# Altium schematic sheet Sheet1.SchDoc
size A4; SheetNumber: 1; SheetTotal: 2
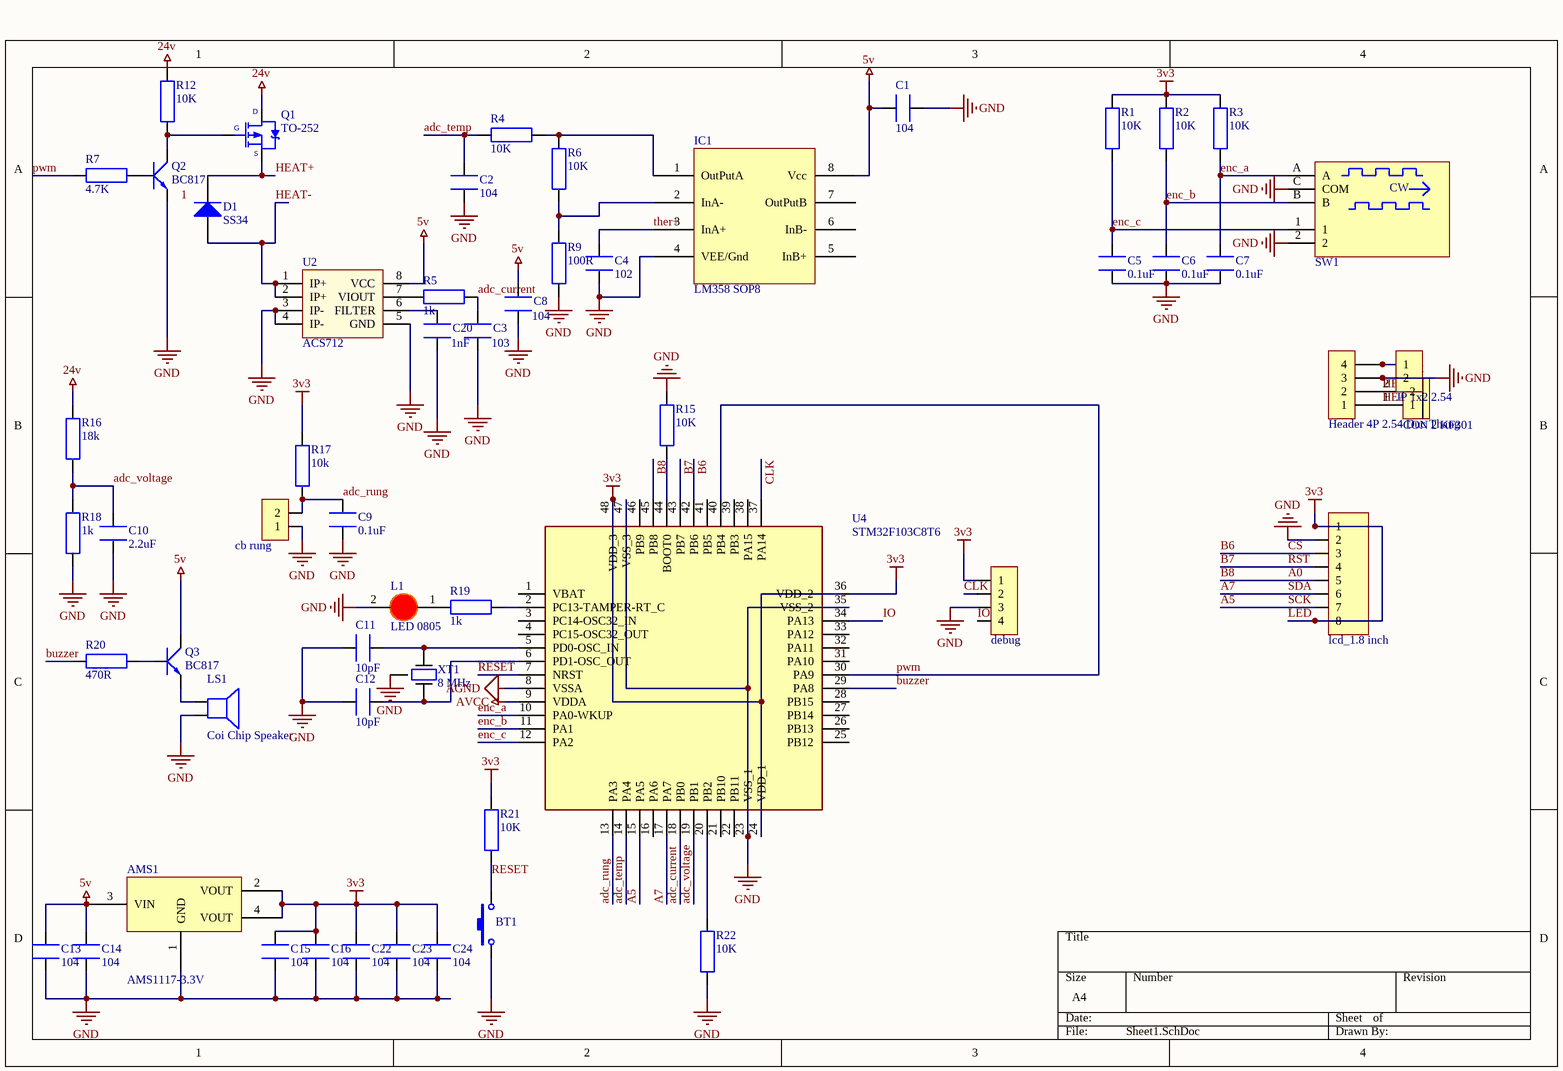
[diagram p0: Sheet1.SchDoc]

## Parts
AMS1  AMS1117-3.3V  [SOT223]
BT1  Nut Nhan 2 Chan SMD 3x6x2.5  [Nut Nhan 2 Chan SMD 3x6x2.5]  (value not drawn)
C1  104  [CAPC1608X09L]
C2  104  [CAPC1608X09L]
C3  103  [CAPC1608X09L]
C4  102  [CAPC1608X09L]
C5  0.1uF  [CAPC1608X09L]
C6  0.1uF  [CAPC1608X09L]
C7  0.1uF  [CAPC1608X09L]
C8  104  [CAPC1608X09L]
C9  0.1uF  [CAPC1608X09L]
C10  2.2uF  [CAPC1608X09L]
C11  10pF  [CAPC1608X09L]
C12  10pF  [CAPC1608X09L]
C13  104  [CAPC1608X09L]
C14  104  [CAPC1608X09L]
C15  104  [CAPC1608X09L]
C16  104  [CAPC1608X09L]
C20  1nF  [CAPC1608X09L]
C22  104  [CAPC1608X09L]
C23  104  [CAPC1608X09L]
C24  104  [CAPC1608X09L]
D1  SS34  [DIODE SMA]
H1  Header 4P 2.54 Duc Thang  [XH2.54M-4]
IC1  LM358 SOP8  [SOP 8]
JP1  debug  [JP 1x4 DT]
JP2  JP 1x2 2.54  [JP 1x2 DT]
JP3  cb rung  [JP 1x2 DT]
JP4  lcd_1.8 inch  [JP 1x8 DT]
KF2  CON 2 KF301  [Con 2 KF301 5.08]
L1  LED 0805  [LED-0805-Red]
LS1  Coi Chip Speaker  [Coi Chip Speacker]
Q1  TO-252  [TO-252-3_L6.6-W6.1-P4.57-LS9.9-BR-CW]
Q2  BC817  [SOT-23]
Q3  BC817  [SOT-23]
R1  10K  [RESC1608X55N]
R2  10K  [RESC1608X55N]
R3  10K  [RESC1608X55N]
R4  10K  [RESC1608X55N]
R5  1k  [RESC1608X55N]
R6  10K  [RESC1608X55N]
R7  4.7K  [RESC1608X55N]
R9  100R  [RESC1608X55N]
R12  10K  [RESC1608X55N]
R15  10K  [RESC1608X55N]
R16  18k  [RESC1608X55N]
R17  10k  [RESC1608X55N]
R18  1k  [RESC1608X55N]
R19  1k  [RESC1608X55N]
R20  470R  [RESC1608X55N]
R21  10K  [RESC1608X55N]
R22  10K  [RESC1608X55N]
SW1  482024764004  [482024764004]  (value not drawn)
U2  ACS712  [SOIC8_50_328_25X90_SMT]
U4  STM32F103C8T6  [LQFP-48_19.6_393_58X11_SMD]
XT1  8 MHz  [DFN220P320X110-4N]

## Nets
5v: AMS1.3(VIN) C1.2 C8.1 C13.2 C14.2 IC1.8(Vcc) Q3.3(C) U2.8(VCC)
24v: Q1.2(D) R12.2 R16.1
AGND: U4.8(VSSA)
AVCC: U4.9(VDDA)
GND: AMS1.1(GND) BT1.1 C1.1 C2.2 C3.2 C4.1 C5.1 C6.1 C7.1 C8.2 C9.2 C10.2 C11.1 C12.1 C13.1 C14.1 C15.1 C16.1 C20.2 C22.1 C23.1 C24.1 H1.3 IC1.4(VEE/Gnd) JP1.3 JP2.2 JP3.1 JP4.2 L1.2(K) LS1.2 Q2.2(E) R9.1 R15.2 R18.2 R22.1 SW1.2 SW1.C(COM) U2.3(IP-) U2.4(IP-) U2.5(GND) U4.23(VSS_1) U4.35(VSS_2) U4.47(VSS_3) XT1.G
LED: AMS1.2(VOUT) AMS1.4(VOUT) C15.2 C16.2 C22.2 C23.2 C24.2 JP1.1 JP4.1 JP4.8 R1.2 R2.2 R3.2 R17.1 R21.2 U4.24(VDD_1) U4.36(VDD_2) U4.48(VDD_3)  [also labelled 3v3]
A0: JP4.5 U4.45(PB8)  [also labelled B8]
A5: JP4.7 U4.15(PA5)  [also labelled SCK]
A7: JP4.6 U4.17(PA7)  [also labelled SDA]
adc_current: C3.1 R5.2 U4.18(PB0)
adc_rung: C9.1 JP3.2 R17.2 U4.13(PA3)
adc_temp: C2.1 R4.2 U4.14(PA4)
adc_voltage: C10.1 R16.2 R18.1 U4.19(PB1)
B6: JP4.3 U4.42(PB6)  [also labelled CS]
B7: JP4.4 U4.43(PB7)  [also labelled RST]
buzzer: R20.2 U4.29(PA8)
CLK: JP1.2 U4.37(PA14)
enc_a: C7.2 R3.1 SW1.A U4.10(PA0-WKUP)
enc_b: C6.2 R2.1 SW1.B U4.11(PA1)
enc_c: C5.2 R1.1 SW1.1 U4.12(PA2)
HEAT+: D1.2(K) H1.2 KF2.2 Q1.3(S)
HEAT-: D1.1(A) H1.1 KF2.1 U2.1(IP+) U2.2(IP+)
IO: JP1.4 U4.34(PA13)
pwm: R7.2 U4.30(PA9) U4.40(PB4)
RESET: BT1.2 R21.1 U4.7(NRST)
ther+: C4.2 H1.4 IC1.3(InA+) JP2.1
NetC11_2: C11.2 U4.5(PD0-OSC_IN) XT1.1
NetC12_2: C12.2 U4.6(PD1-OSC_OUT) XT1.3
NetC20_1: C20.1 U2.6(FILTER)
NetIC1_1: IC1.1(OutPutA) R4.1 R6.2
NetIC1_2: IC1.2(InA-) R6.1 R9.2
NetL1_1: L1.1(A) R19.2
NetLS1_1: LS1.1 Q3.2(E)
NetQ1_1: Q1.1(G) Q2.3(C) R12.1
NetQ2_1: Q2.1(B) R7.1
NetQ3_1: Q3.1(B) R20.1
NetR5_1: R5.1 U2.7(VIOUT)
NetR15_1: R15.1 U4.44(BOOT0)
NetR19_1: R19.1 U4.2(PC13-TAMPER-RT_C)
NetR22_2: R22.2 U4.20(PB2)

Not connected (* = marked no-connect by the designer): IC1 5(InB+) 6(InB-) 7(OutPutB); U4 1(VBAT) 3(PC14-OSC32_IN) 4(PC15-OSC32_OUT) 16(PA6) 21(PB10) 22(PB11) 25(PB12) 26(PB13) 27(PB14) 28(PB15) 31(PA10) 32(PA11) 33(PA12) 38(PA15) 39(PB3) 41(PB5) 46(PB9)

## Notes on the sheet
- Labels drawn without touching a wire or pin: 1
- (in symbol 482024764004) CW

## Library data of the parts
AMS1 = AMS1117 SMD: Dán; Value: AMS1117-3.3V SOT223; Don_Vi: Con; Ma_Hang: MH000596; Ghi_Chu: *; Kieu_Chan: *; Chung_Loai: Dán
BT1 = Nut Nhan 2 Chan SMD 3x6x2.5: Ma_Hang: MH001036; Ten: Nút Nhấn 2 Chân 3x6x2.5MM SMD
C1-C16 C20 C22-C24 = GRM188R71H104KA93D: CAP CER 0.1UF 50V X7R 0603; Manufacturer: Murata Electronics North America; Tolerance: ±10%; Supplier 1: Digi-Key; Supplier Part Number 1: 490-1519-2-ND; Manufacturer Part Number: GRM188R71H104KA93D; RoHS: RoHS Compliant; Category: Capacitors; Pricing 1: 4000=0.01822, 8000=0.01663, 12000=0.01584 (USD); Packaging: Tape & Reel (TR); Capacitance: 0.1uF; Voltage - Rated: 50V; Temperature Coefficient: X7R; Mounting Type: Surface Mount, MLCC; Operating Temperature: -55°C ~ 125°C; Applications: General Purpose; Ratings: -; Package / Case: 0603 (1608 Metric); Size / Dimension: 0.063" L x 0.032" W (1.60mm x 0.80mm); Height - Seated (Max): -; Thickness (Max): 0.035" (0.90mm); Lead Spacing: -; Features: -; Lead Style: -; ComponentLink1URL: http://www.murata.com/~/media/webrenewal/support/library/catalog/products/capacitor/mlcc/c02e.ashx?la=en-us; ComponentLink1Description: http://www.murata.com/~/media/webrenewal/support/library/catalog/products/capacitor/mlcc/c02e.ashx?la=en-us; Stock: 19812000; Part Status: Active; Supplier 2: Digi-Key; Supplier Part Number 2: 490-1519-1-ND; Pricing 2: 1=0.12, 10=0.084, 100=0.0396, 500=0.02778, 1000=0.023 (USD)
D1 = Diode SS34 ( 1N5822 ): Dán; Don_Vi: Con; Ma_Hang: MH002104; Ten_Linh_Kien: Diode SS34 3A 40V SMA ( 1N5822 SS34A); Kieu_Chan: *; Chung_Loai: Dán
H1 = Header 4P 2.54 Duc Thang: Cắm; Ten_Linh_Kien: Header 4P XH2.54-4P Đực Thẳng; Don_Vi: Con; Ma_Hang: MH001285; Chung_Loai: Cắm
IC1 = LM358 SOP8: Dán; Ma_Hang: MH000609; Don_Vi: Con; Ten_Linh_Kien: LM358 SOP8; Kieu_Chan: *; Ghi_Chu: *; Chung_Loai: Dán
JP1 = JP 1x4 2.54 Duc Thang: Cắm; Ten_Linh_Kien: Jump Đơn Đực 2.54MM 1x40P Thẳng 11MM; Don_Vi: Con; Ma_Hang: MH000903; Ghi_Chu: *; Kieu_Chan: *; Chung_Loai: Cắm
JP2 JP3 = JP 1x2 2.54 Duc Thang: Cắm; Ten_Linh_Kien: Jump Đơn Đực 2.54MM 1x40P Thẳng 11MM; Don_Vi: Con; Ma_Hang: MH000903; Ghi_Chu: *; Kieu_Chan: *; Chung_Loai: Cắm
JP4 = JP 1x8 2.54 Duc Thang: Cắm; Ten_Linh_Kien: Jump Đơn Đực 2.54MM 1x40P Thẳng 11MM; Don_Vi: Con; Ma_Hang: MH000903; Ghi_Chu: *; Kieu_Chan: *; Chung_Loai: Cắm
KF2 = CON 2 KF301: Cắm; Ma_Hang: MH000987; Ten_Linh_Kien: CON 2 KF301-2P 5.08MM Xanh Dương; Chung_Loai: Cắm; Ghi_Chu: *; Kieu_Chan: *; Don_Vi: Con
L1 = LED 0805 Do: Dán; Don_Vi: Con; Ma_Hang: MH000897; Ten_Linh_Kien: LED 0805 Màu Đỏ (Red); Ghi_Chu: *; Kieu_Chan: *; Chung_Loai: Dán
LS1 = Coi Chip Speaker: Còi chip
Q1 = FET AO D409: P-Channel Power MOSFET; Note: Pin 2 is electrically connected to pin 4.; Published: 8-Jun-2000; LatestRevisionDate: 17-Jul-2002; LatestRevisionNote: Re-released for DXP Platform.; DatasheetVersion: PD-9.421C; PackageVersion: Feb-1997; PackageReference: TO-220AB; Publisher: Altium Limited; PackageDescription: TO, Thru-Hole, Vertical, Heatsink Mounted; 3 In-Line Leads; Pitch 2.54 mm; ComponentLink1Description: Manufacturer Link; ComponentLink1URL: http://www.irf.com/; ComponentLink2Description: Datasheet; ComponentLink2URL: http://www.irf.com/product-info/datasheets/data/irf9540.pdf
Q2 Q3 = Trans BC817: SOT-23 - C8658; Value: C9014
R1-R4 R6 R9 R15 R19-R22 = RC0603FR-0710KL: RES SMD 10K OHM 1% 1/10W 0603; Manufacturer: Yageo; Power (Watts): 0.1W, 1/10W; Temperature Coefficient: ±100ppm/°C; Supplier 1: Digi-Key; Supplier Part Number 1: 311-10.0KHRCT-ND; Manufacturer Part Number: RC0603FR-0710KL; RoHS: RoHS Compliant; Category: Resistors; Stock 1: 13504930; Pricing 1: 1=0.1, 10=0.014, 25=0.01, 100=0.0057, 250=0.00436, 500=0.00348, 1000=0.00257, 2500=0.00223 (USD); Packaging: Cut Tape (CT); Resistance (Ohms): 10k; Tolerance: ±1%; Composition: Thick Film; Features: Moisture Resistant; Operating Temperature: -55°C ~ 155°C; Package / Case: 0603 (1608 Metric); Supplier Device Package: 0603; Size / Dimension: 0.063" L x 0.031" W (1.60mm x 0.80mm); Height: 0.022" (0.55mm); Number of Terminations: 2; ComponentLink1URL: http://www.yageo.com/documents/recent/PYu-RC_Group_51_RoHS_L_04.pdf; ComponentLink1Description: http://www.yageo.com/documents/recent/PYu-RC_Group_51_RoHS_L_04.pdf
R5 R16-R18 = RC0603FR-072R2L: RES SMD 2.2 OHM 1% 1/10W 0603; Manufacturer: Yageo; Resistance (Ohms): 2.2; Power (Watts): 0.1W, 1/10W; Temperature Coefficient: ±200ppm/°C; Supplier 1: Digi-Key; Supplier Part Number 1: 311-2.2HRCT-ND; Manufacturer Part Number: RC0603FR-072R2L; RoHS: RoHS Compliant; Category: Resistors; Stock 1: 16531; Pricing 1: 1=0.1, 10=0.02, 25=0.0144, 100=0.0082, 250=0.00624, 500=0.00498, 1000=0.00367, 2500=0.00319 (USD); Packaging: Cut Tape (CT); Tolerance: ±1%; Composition: Thick Film; Features: Moisture Resistant; Operating Temperature: -55°C ~ 155°C; Package / Case: 0603 (1608 Metric); Supplier Device Package: 0603; Size / Dimension: 0.063" L x 0.031" W (1.60mm x 0.80mm); Height: 0.022" (0.55mm); Number of Terminations: 2; ComponentLink1URL: http://www.yageo.com/documents/recent/PYu-RC_Group_51_RoHS_L_04.pdf; ComponentLink1Description: http://www.yageo.com/documents/recent/PYu-RC_Group_51_RoHS_L_04.pdf
R7 = RC0603FR-0747KL: RES SMD 47K OHM 1% 1/10W 0603; Manufacturer: Yageo; Power (Watts): 0.1W, 1/10W; Temperature Coefficient: ±100ppm/°C; Supplier 1: Digi-Key; Supplier Part Number 1: 311-47.0KHRCT-ND; Manufacturer Part Number: RC0603FR-0747KL; RoHS: RoHS Compliant; Category: Resistors; Stock 1: 930868; Pricing 1: 1=0.1, 10=0.014, 25=0.01, 100=0.0057, 250=0.00436, 500=0.00348, 1000=0.00257, 2500=0.00223 (USD); Packaging: Cut Tape (CT); Resistance (Ohms): 47k; Tolerance: ±1%; Composition: Thick Film; Features: Moisture Resistant; Operating Temperature: -55°C ~ 155°C; Package / Case: 0603 (1608 Metric); Supplier Device Package: 0603; Size / Dimension: 0.063" L x 0.031" W (1.60mm x 0.80mm); Height: 0.022" (0.55mm); Number of Terminations: 2; ComponentLink1URL: http://www.yageo.com/documents/recent/PYu-RC_Group_51_RoHS_L_04.pdf; ComponentLink1Description: http://www.yageo.com/documents/recent/PYu-RC_Group_51_RoHS_L_04.pdf
R12 = RC0603FR-0722RL: RES SMD 22 OHM 1% 1/10W 0603; Manufacturer: Yageo; Resistance (Ohms): 22; Power (Watts): 0.1W, 1/10W; Temperature Coefficient: ±100ppm/°C; Supplier 1: Digi-Key; Supplier Part Number 1: 311-22.0HRCT-ND; Manufacturer Part Number: RC0603FR-0722RL; RoHS: RoHS Compliant; Category: Resistors; Stock 1: 575303; Pricing 1: 1=0.1, 10=0.014, 25=0.01, 100=0.0057, 250=0.00436, 500=0.00348, 1000=0.00257, 2500=0.00223 (USD); Packaging: Cut Tape (CT); Tolerance: ±1%; Composition: Thick Film; Features: Moisture Resistant; Operating Temperature: -55°C ~ 155°C; Package / Case: 0603 (1608 Metric); Supplier Device Package: 0603; Size / Dimension: 0.063" L x 0.031" W (1.60mm x 0.80mm); Height: 0.022" (0.55mm); Number of Terminations: 2; ComponentLink1URL: http://www.yageo.com/documents/recent/PYu-RC_Group_51_RoHS_L_04.pdf; ComponentLink1Description: http://www.yageo.com/documents/recent/PYu-RC_Group_51_RoHS_L_04.pdf
SW1 = 482024764004: WS-ENTV Mechanical Incremental Encoder Switch, Plastic Shaft without bushing, 24Pulse/360°, 24positi; Manufacturer: Wurth Elektronik; Operation Force: 300g; Detent: 24positions; Electrical Life Encoder: 30000Cycles; Electrical Life Switch: 20000Cycles; Insulation Resistance: 100MΩ; Rated Current: 10mA; ComponentLink1Description: Website Link; ComponentLink1URL: https://www.we-online.com/redexpert/article/482024764004?ad; ComponentLink2Description: Datasheet Link; ComponentLink2URL: https://www.we-online.com/redexpert/spec/482024764004?ad; Manufacturer Part Number: 482024764004; Category: Encoder Switches; Match Code: WS-ENTV; Mount: Through Hole; Operating Temperature Max: 85°C; Operating Temperature Min: -40°C; Packaging: Tray; Length: 13.2mm; Width: 12.4mm; Height: 20mm; Resolution: 24Pulse/360°
U2 = ACS712: ACS712 Hall Effect-Based Linear Current Sensor
U4 = IC_STM32F103C8T6: ARM® Cortex®-M3 STM32F1 Microcontroller IC 32-Bit 72MHz 64KB (64K x 8) FLASH 48-LQFP (7x7) /; Manufacturer: STMicroelectronics; Alternate Part Number-1: NA; Manufacturer Part Number: STM32F103C8T6; Case/Package: LQFP48; Supplier-1: LCSC; Supplier Part Number-1: STM32F103C8T6
XT1 = ABM3B-8.000MHZ-10-1-U-T: Crystal 8MHz ±10ppm 10pF 200 Ohm -10°C ~ 60°C Surface Mount 4-SMD, No Lead (DFN, LCC); Manufacturer: Abracon LLC; Operating Mode: Fundamental; Value: 8 MHz; Supplier 1: Digi-Key; Supplier Part Number 1: 535-9721-1-ND; RoHS: RoHS Compliant; Category: Crystals, Oscillators, Resonators; Stock: 35437; Pricing 1: 1=0.69, 10=0.578, 50=0.5198, 100=0.462, 500=0.4389 (USD); Packaging: Cut Tape (CT); Part Status: Active; Type: MHz Crystal; Frequency Stability: ±10ppm; Frequency Tolerance: ±10ppm; Load Capacitance: 10pF; Operating Temperature: -10°C ~ 60°C; Ratings: -; Mounting Type: Surface Mount; Package / Case: 4-SMD, No Lead; Size / Dimension: 0.197" L x 0.126" W (5.00mm x 3.20mm); Height - Seated (Max): 0.043" (1.10mm); ComponentLink1URL: http://www.abracon.com/Resonators/abm3b.pdf; ComponentLink1Description: http://www.abracon.com/Resonators/abm3b.pdf; Supplier 2: Digi-Key; Supplier Part Number 2: 535-9721-2-ND; Pricing 2: 1000=0.336, 3000=0.315, 5000=0.3045, 10000=0.294 (USD); Manufacturer Part Number: ABM3B-8.000MHZ-10-1-U-T